# Altium schematic sheet EXTADC.SchDoc
size A; SheetNumber: 13; SheetTotal: 15
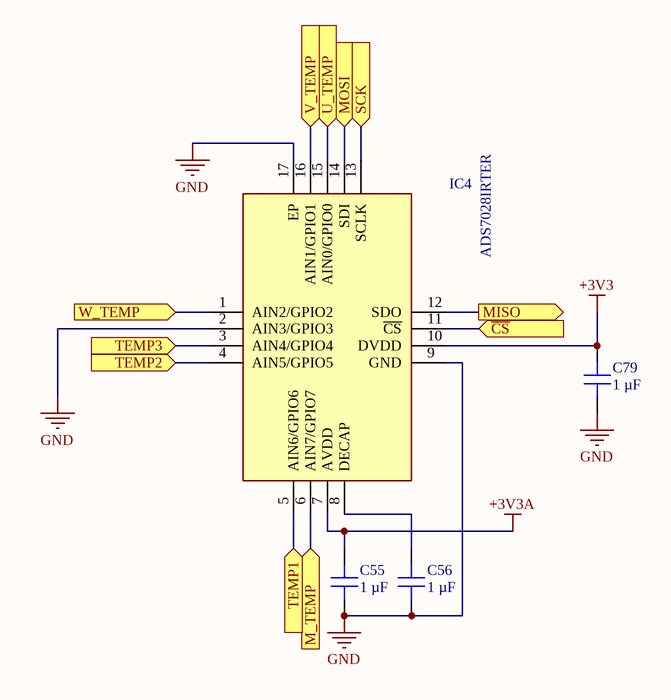
[diagram p0: EXTADC.SchDoc]

## Parts
C55  1 µF  [MURATA GRM155 0402_1005]
C56  1 µF  [MURATA GRM155 0402_1005]
C79  1 µF  [MURATA GRM155 0402_1005]
IC4  ADS7028IRTER  [QFN50P300X300X80-17N-D]

## Ports
M_TEMP (in), MISO (out), MOSI (in), SCK (in), TEMP1 (in), TEMP2 (in), TEMP3 (in), U_TEMP (in), V_TEMP (in), W_TEMP (in), ~{CS} (in)

## Nets
+3V3: C79.2 IC4.10(DVDD)
+3V3A: C55.2 IC4.7(AVDD)
GND: C55.1 C56.1 C79.1 IC4.2(AIN3/GPIO3) IC4.9(GND) IC4.17(EP)
~{CS}: IC4.11(~{CS}) ; port ~{CS}
M_TEMP: IC4.6(AIN7/GPIO7) ; port M_TEMP
MISO: IC4.12(SDO) ; port MISO
MOSI: IC4.14(SDI) ; port MOSI
SCK: IC4.13(SCLK) ; port SCK
TEMP1: IC4.5(AIN6/GPIO6) ; port TEMP1
TEMP2: IC4.4(AIN5/GPIO5) ; port TEMP2
TEMP3: IC4.3(AIN4/GPIO4) ; port TEMP3
U_TEMP: IC4.15(AIN0/GPIO0) ; port U_TEMP
V_TEMP: IC4.16(AIN1/GPIO1) ; port V_TEMP
W_TEMP: IC4.1(AIN2/GPIO2) ; port W_TEMP
NetC56_2: C56.2 IC4.8(DECAP)

## Library data of the parts
C55 C56 C79 = GRM155C71A105KE11D: CAP CER 1UF 10V X7S 0402; manufacturer: Murata Electronics; Tolerance: ±10%; Part Number: GRM155C71A105KE11D; Capacitance: 1 µF; Applications: General Purpose; componentlink1description: Datasheet; componentlink1url: https://search.murata.co.jp/Ceramy/image/img/A01X/G101/ENG/GRM155C71A105KE11-01.pdf; componentlink2description: DigiKey Link; componentlink2url: https://www.digikey.com/en/products/detail/murata-electronics/GRM155C71A105KE11D/6606086; Device Package: 0402 (1005 Metric); lastupdated: 7/23/2025 10:42:36 AM; Lifecycle Status: Active; Minimum Order: 1; Mounting Type: Surface Mount, MLCC; Operating Temperature: -55°C ~ 125°C; Package / Case: 0402 (1005 Metric); packaging: TapeAndReel; partid: 1749; Part Status: Active; price: 0.01; series: GRM; Size / Dimension: 0.039" L x 0.020" W (1.00mm x 0.50mm); Supplier 1: DigiKey; Supplier Part Number 1: 490-14457-1-ND; Temperature Coefficient: X7S; Thickness (Max): 0.024" (0.60mm); value: 1 µF; Voltage - Rated: 10V
IC4 = ADS7028IRTER: Integrated Circuit; Manufacturer_Name: Texas Instruments; Datasheet Link: https://www.arrow.com/en/products/ads7028irter/texas-instruments; Height: 0.8mm; Manufacturer_Part_Number: ADS7028IRTER; Mouser Part Number: 595-ADS7028IRTER; Mouser Price/Stock: https://www.mouser.co.uk/ProductDetail/Texas-Instruments/ADS7028IRTER?qs=%252B6g0mu59x7L0mzHBJBWvJw%3D%3D; Arrow Part Number: ADS7028IRTER; Arrow Price/Stock: https://www.arrow.com/en/products/ads7028irter/texas-instruments